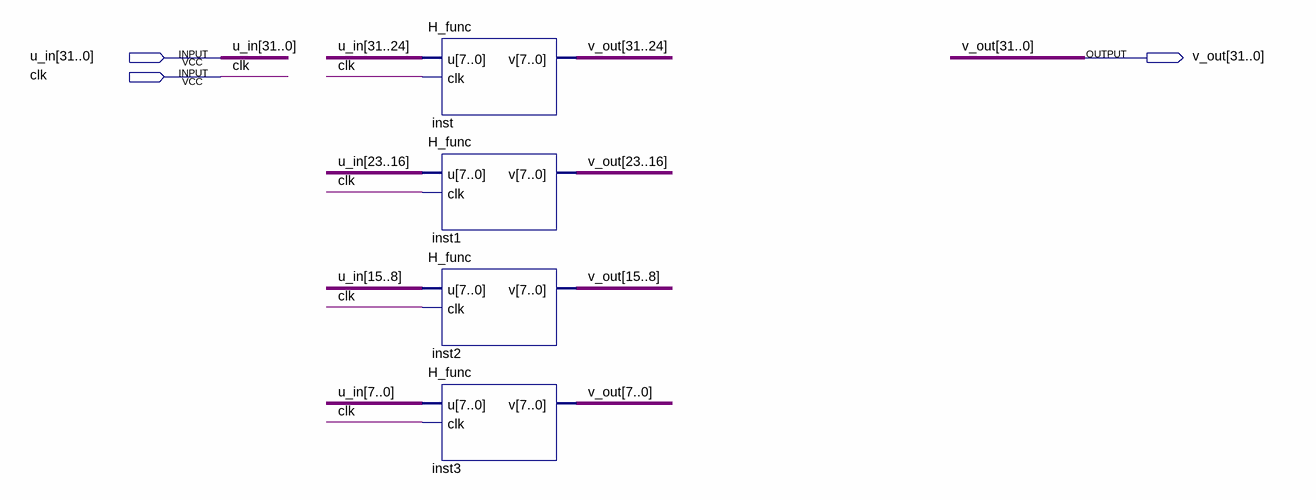
[diagram p0: schematic sheet]
// Quartus schematic G_func.bdf as structural Verilog: 4 symbols, 3 pins
module G_func (
  input  [31:0] u_in,
  input  clk,
  output [31:0] v_out
);

  H_func inst (.u(u_in[31:24]), .clk(clk), .v(v_out[31:24]));
  H_func inst1 (.u(u_in[23:16]), .clk(clk), .v(v_out[23:16]));
  H_func inst2 (.u(u_in[15:8]), .clk(clk), .v(v_out[15:8]));
  H_func inst3 (.u(u_in[7:0]), .clk(clk), .v(v_out[7:0]));
endmodule
